# Altium schematic sheet Power.SchDoc
size A3; SheetNumber: 2; SheetTotal: 6
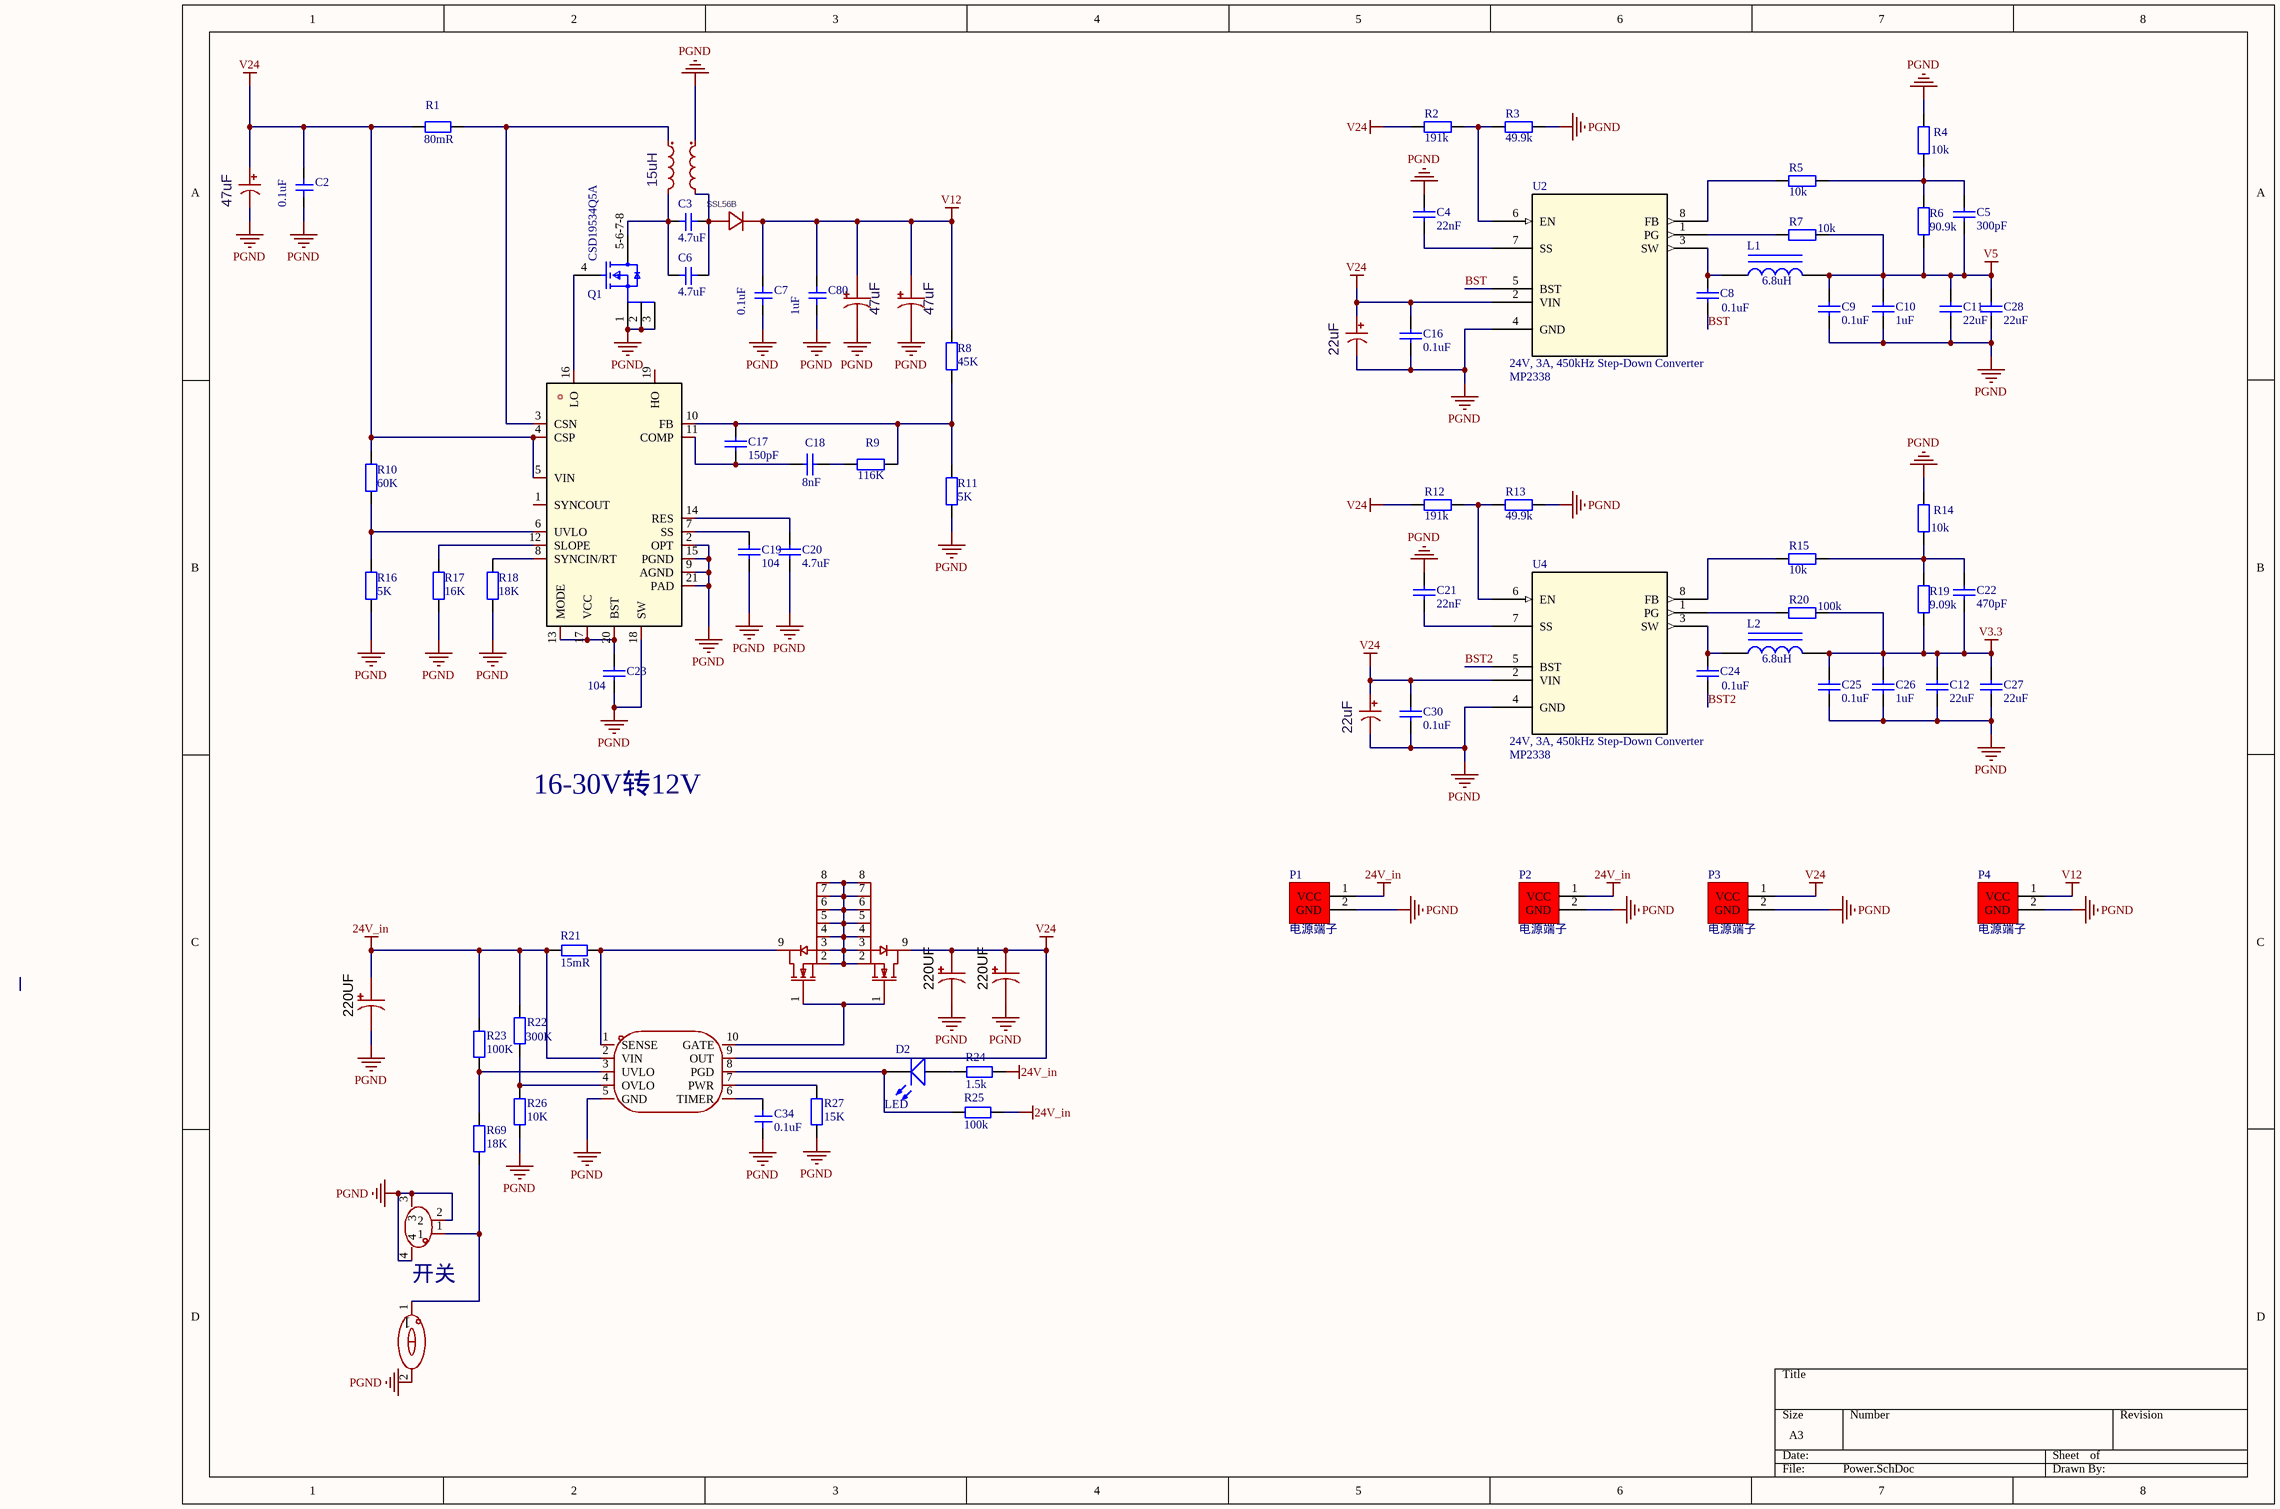
[diagram p0: Power.SchDoc]

## Parts
C1  47uF  [CAP-SMD_BD6.3-L6.6-W6.6-LS7.6-FD]
C2  0.1uF  [0603C]
C3  4.7uF  [1206_C]
C4  22nF  [0402_C]
C5  300pF  [0402_C]
C6  4.7uF  [1206_C]
C7  0.1uF  [0603C]
C8  0.1uF  [0603_C]
C9  0.1uF  [0603_C]
C10  1uF  [0603_C]
C11  22uF  [1210_C]
C12  22uF  [1210_C]
C13  47uF  [CAP-SMD_BD6.3-L6.6-W6.6-LS7.6-FD]
C14  47uF  [CAP-SMD_BD6.3-L6.6-W6.6-LS7.6-FD]
C15  22uF  [CAP-SMD_BD6.3-L6.6-W6.6-LS7.6-FD]
C16  0.1uF  [0603_C]
C17  150pF  [0402_C]
C18  8nF  [0402_C]
C19  104  [0402_C]
C20  4.7uF  [0603_C]
C21  22nF  [0402_C]
C22  470pF  [0402_C]
C23  104  [0402_C]
C24  0.1uF  [0603_C]
C25  0.1uF  [0603_C]
C26  1uF  [0603_C]
C27  22uF  [1210_C]
C28  22uF  [1210_C]
C29  22uF  [CAP-SMD_BD6.3-L6.6-W6.6-LS7.6-FD]
C30  0.1uF  [0603_C]
C31  220UF  [CAP-SMD_BD10.0-L10.3-W10.3-LS11.3-FD]
C32  220UF  [CAP-SMD_BD10.0-L10.3-W10.3-LS11.3-FD]
C33  220UF  [CAP-SMD_BD10.0-L10.3-W10.3-LS11.3-FD]
C34  0.1uF  [0402_C]
C80  1uF  [0603C]
D1  SSL56B  [SMBF_L4.3-W3.6-LS5.3-RD]
D2  LED  [0805_LED]
L1  6.8uH  [IND-SMD_L7.0-W6.6]
L2  6.8uH  [IND-SMD_L7.0-W6.6]
P1  电源端子  [XT60PB-F]
P2  电源端子  [XT60PB-F]
P3  电源端子  [XT60PB-F]
P4  电源端子  [XT30-F]
Q1  CSD19534Q5A  [FP-DQJ0008A-MFG]
Q2  HYG006N04LS1TA  [TOLL-8_L10.4-W9.9-P1.20-LS11.7-BL]  (value not drawn)
Q3  HYG006N04LS1TA  [TOLL-8_L10.4-W9.9-P1.20-LS11.7-BL]  (value not drawn)
R1  80mR  [2512]
R2  191k  [0402_R]
R3  49.9k  [0402_R]
R4  10k  [0402_R]
R5  10k  [0402_R]
R6  90.9k  [0402_R]
R7  10k  [0402_R]
R8  45K  [0402_R]
R9  116K  [0402_R]
R10  60K  [0402_R]
R11  5K  [0402_R]
R12  191k  [0402_R]
R13  49.9k  [0402_R]
R14  10k  [0402_R]
R15  10k  [0402_R]
R16  5K  [0402_R]
R17  16K  [0402_R]
R18  18K  [0402_R]
R19  9.09k  [0402_R]
R20  100k  [0402_R]
R21  15mR  [2512]
R22  300K  [0402_R]
R23  100K  [0402_R]
R24  1.5k  [0402_R]
R25  100k  [0402_R]
R26  10K  [0402_R]
R27  15K  [0402_R]
R69  18K  [0402_R]
SW1  DSIC01LS-P  [SW-SMD_2P-L3.5-W6.2-P2.54-LS9.8]  (value not drawn)
U1  15uH  [IND-SMD_4P-L12.0-W12.0_496R8C]
U2  24V, 3A, 450kHz Step-Down Converter  [SOT583_MP2338_MNP]
U3  LM5122MHX/NOPB  [HTSSOP-20_L6.5-W4.4-P0.65-LS6.4-BL-EP]  (value not drawn)
U4  24V, 3A, 450kHz Step-Down Converter  [SOT583_MP2338_MNP]
U5  LM5069MMX-2/NOPB  [VSSOP-10_L3.0-W3.0-P0.50-LS4.9-BL]  (value not drawn)
U6  ZX-XH2.54-2PLT  [HC-1.25-2]  (value not drawn)

## Nets
24V_in: C33.1 P1.1(VCC) P2.1(VCC) R21.2 R22.2 R23.2 R24.1 R25.1 U5.2(VIN)
PGND: C1.2 C2.1 C4.2 C7.1 C9.1 C10.1 C11.1 C12.1 C13.2 C14.2 C15.2 C16.1 C19.1 C20.1 C21.2 C23.1 C25.1 C26.1 C27.1 C28.1 C29.2 C30.1 C31.2 C32.2 C33.2 C34.1 C80.1 P1.2(GND) P2.2(GND) P3.2(GND) P4.2(GND) Q1.1(S) Q1.2(S) Q1.3(S) R3.1 R4.2 R11.1 R13.1 R14.2 R16.1 R17.1 R18.1 R26.1 R27.2 SW1.2(PIN2) U1.2 U2.4(GND) U3.2(OPT) U3.9(AGND) U3.15(PGND) U3.18(SW) U3.21(PAD) U4.4(GND) U5.5(GND) U6.2 U6.3 U6.4
V3.3: C12.2 C22.1 C25.2 C26.2 C27.2 L2.2 R19.1 R20.2
V5: C5.1 C9.2 C10.2 C11.2 C28.2 L1.2 R6.1 R7.2
V12: C7.2 C13.1 C14.1 C80.2 D1.1 P4.1(VCC) R8.2
V24: C1.1 C2.2 C15.1 C16.2 C29.1 C30.2 C31.1 C32.1 P3.1(VCC) Q3.9(D) R1.1 R2.2 R10.2 R12.2 U2.2(VIN) U3.4(CSP) U3.5(VIN) U4.2(VIN) U5.9(OUT)
BST: C8.1 U2.5(BST)
BST2: C24.1 U4.5(BST)
NetC3_1: C3.1 C6.1 Q1.5-6-7-8(D) U1.3
NetC3_2: C3.2 C6.2 D1.2 U1.4
NetC4_1: C4.1 U2.7(SS)
NetC5_2: C5.2 R4.1 R5.1 R6.2
NetC8_2: C8.2 L1.1 U2.3(SW)
NetC17_1: C17.1 C18.1 U3.11(COMP)
NetC17_2: C17.2 R8.1 R9.2 R11.2 U3.10(FB)
NetC18_2: C18.2 R9.1
NetC19_2: C19.2 U3.7(SS)
NetC20_2: C20.2 U3.14(RES)
NetC21_1: C21.1 U4.7(SS)
NetC22_2: C22.2 R14.1 R15.1 R19.2
NetC23_2: C23.2 U3.13(MODE) U3.17(VCC) U3.20(BST)
NetC24_2: C24.2 L2.1 U4.3(SW)
NetC34_2: C34.2 U5.6(TIMER)
NetD2_A: D2.A R24.2
NetD2_K: D2.K R25.2 U5.8(PGD)
NetQ1_4: Q1.4(G) U3.16(LO)
NetQ2_1: Q2.1(G) Q3.1(G) U5.10(GATE)
NetQ2_2: Q2.2(S) Q2.3(S) Q2.4(S) Q2.5(S) Q2.6(S) Q2.7(S) Q2.8(S) Q3.2(S) Q3.3(S) Q3.4(S) Q3.5(S) Q3.6(S) Q3.7(S) Q3.8(S)
NetQ2_9: Q2.9(D) R21.1 U5.1(SENSE)
NetR1_2: R1.2 U1.1 U3.3(CSN)
NetR2_1: R2.1 R3.2 U2.6(EN)
NetR5_2: R5.2 U2.8(FB)
NetR7_1: R7.1 U2.1(PG)
NetR10_1: R10.1 R16.2 U3.6(UVLO)
NetR12_1: R12.1 R13.2 U4.6(EN)
NetR15_2: R15.2 U4.8(FB)
NetR17_2: R17.2 U3.12(SLOPE)
NetR18_2: R18.2 U3.8(SYNCIN/RT)
NetR20_1: R20.1 U4.1(PG)
NetR22_1: R22.1 R26.2 U5.4(OVLO)
NetR23_1: R23.1 R69.2 U5.3(UVLO)
NetR27_1: R27.1 U5.7(PWR)
NetR69_1: R69.1 SW1.1(PIN1) U6.1

Not connected (* = marked no-connect by the designer): U3 1(SYNCOUT) 19(HO)

## Notes on the sheet
- (near U2) MP2338
- (near U4) MP2338
- 16-30V转12V
- 开关

## Library data of the parts
C1 = cap: 电解电容; Manufacturer: ROQANG(容强); Symbol: RVT1H470M0607; Device: RVT1H470M0607_C72523; Add into BOM: yes; Tolerance: ±20%; Rated Voltage: 50V; Ripple Current: 66mA@120Hz; φD: 6.3mm; L: 7.7mm; Lifetime @ Temp: 2000hrs@105℃; LCSC Part Name: 47uF ±20% 50V; Supplier Part: C72523; Manufacturer Part: RVT1H470M0607; Supplier Footprint: SMD,D6.3xL7.7mm; JLCPCB Part Class: Extended Part; Datasheet: https://atta.szlcsc.com/upload/public/pdf/source/20170325/1490427950282.pdf; Supplier: LCSC; Convert to PCB: yes; Value: 47uF; Equivalent Series Resistance(ESR): -; Operating Temperature: -40℃~+105℃
C2 C3 C6 C7 C34 C80 = Cap1: 无极贴片电容
C4 C5 C8-C12 C16-C28 C30 = SMT_Cap: 贴片电容; ComponentLink1Description: 供应商链接; ComponentLink1URL: http://www.szlcsc.com/product/details_29010.html; Package: 0805; Supplier: LC; SuppliersPartNumber: C28260
C13 C14 = cap2: 47uf 63v 2.1A@100KHZ; Manufacturer: PANASONIC(松下); Symbol: 50SVPF39M; Add into BOM: yes; Value: 39uF; Tolerance: ±20%; Rated Voltage: 50V; Ripple Current: 3.8A@100kHz; Equivalent Series Resistance(ESR): 25mΩ@100kHz; Type: 聚合物; φD: 8mm; L: 11.9mm; Lifetime @ Temp: 5000hrs@105℃; Device: 50SVPF39M; LCSC Part Name: 39uF ±20% 50V; Supplier Part: C193240; Manufacturer Part: 50SVPF39M; Supplier Footprint: SMD,D8xL11.9mm; JLCPCB Part Class: Extended Part; Datasheet: https://atta.szlcsc.com/upload/public/pdf/source/20180515/C193240_1760EBD42554E7EBE44F52996FA994CF.pdf; Supplier: LCSC; Convert to PCB: yes; Lead Spacing: 3.5mm; Operating Temperature: -55℃~+105℃
C15 C29 = cap: 电解电容; Manufacturer: ROQANG(容强); Symbol: RVT1H470M0607; Device: RVT1H470M0607_C72523; Add into BOM: yes; Value: 47uF; Tolerance: ±20%; Rated Voltage: 50V; Ripple Current: 66mA@120Hz; φD: 6.3mm; L: 7.7mm; Lifetime @ Temp: 2000hrs@105℃; LCSC Part Name: 47uF ±20% 50V; Supplier Part: C72523; Manufacturer Part: RVT1H470M0607; Supplier Footprint: SMD,D6.3xL7.7mm; JLCPCB Part Class: Extended Part; Datasheet: https://atta.szlcsc.com/upload/public/pdf/source/20170325/1490427950282.pdf; Supplier: LCSC; Convert to PCB: yes; Equivalent Series Resistance(ESR): -; Operating Temperature: -40℃~+105℃
C31-C33 = cap: 4.7uf 50v 14mA@120HZ; Manufacturer: ROQANG(容强); Symbol: VT1H4R7M0405; Add into BOM: yes; Tolerance: ±20%; φD: 4mm; L: 5.4mm; Lifetime @ Temp: 2000hrs@105℃; Device: VT1H4R7M0405; LCSC Part Name: 4.7uF ±20% 50V; Supplier Part: C213488; Manufacturer Part: VT1H4R7M0405; Supplier Footprint: SMD,D4xL5.4mm; JLCPCB Part Class: Extended Part; Datasheet: https://atta.szlcsc.com/upload/public/pdf/source/20180502/C191859_5B846418F1FC4C14CCCE0409874E2ED6.pdf; Supplier: LCSC; Convert to PCB: yes; Value: 4.7uF; Rated Voltage: 50V; Ripple Current: 14mA@120Hz; Equivalent Series Resistance(ESR): -; Operating Temperature: -40℃~+105℃
D1 = SSL56B_C28646279: 正向压降(Vf): 500mV@5A / 直流反向耐压(Vr): 60V / 整流电流: 5A 肖特基二极管; Manufacturer: 宏迦橙; Add into BOM: yes; Diode Configuration: 独立式; Reverse Leakage Current (Ir): 1mA@60V; Symbol: SSL56B_C28646279; Device: SSL56B_C28646279; LCSC Part Name: 电压:60V 电流:5A; Supplier Part: C28646279; Manufacturer Part: SSL56B; Supplier Footprint: SMB; JLCPCB Part Class: Extended Part; Datasheet: https://atta.szlcsc.com/upload/public/pdf/source/20240711/BA5CC29A704E203730EE96C503711B74.pdf; Supplier: LCSC; Convert to PCB: yes; Forward Voltage (Vf@If): 500mV@5A; Reverse Voltage (Vr): 60V; Rectified Current: 5A
D2 = LED: 发光二极管; ComponentLink1Description: 供应商链接; ComponentLink1URL: http://www.szlcsc.com/product/details_2663.html; Package: 0603; Supplier: LC; SuppliersPartNumber: C2290
L1 L2 = SMT_Iud_Power: 功率电感; ComponentLink1Description: 供应商链接; ComponentLink1URL: http://www.szlcsc.com/product/details_30010.html; Package: 0603; Supplier: LC; SuppliersPartNumber: C29258
Q1 = CMP-04962-000018-1: MOSFET N-CH 100V 50 8SON; Manufacturer: Texas Instruments; Reverse Recovery Time: 53ns; Turn Off Delay Time: 20ns; Gate To Source Voltage: 20V; Turn On Delay Time: 9ns; Depletion Mode: False; Threshold Vgs Max: 3.4V; Pulse Drain Current: 137A; Number Of N Channels: 1; Input Capacitace At Vds: 1290pF @ 50V; Max Junction Temp: +150°C; Power Dissipation: 3.2W; Max Forward Diode Voltage: 1V; Continuous Drain Current: 10A; Drain To Source Resistance: 12.6mΩ; Threshold Vgs Min: 2.4V; Transconductance: 47S; Gate Charge At Vgs: 17nC @ 10V; Reverse Recovery Charge: 134nC; Typ Forward Diode Voltage: 0.8V; Rthja Max: 50°C/W; Drain To Source Breakdown Voltage: 100V; Device Class L2: Transistors; Height: 1.1mm; Temperature Range Low: -55°C; Temperature Range High: +150°C; Temperature: -55°C to +150°C; Device Class L1: Discrete Semiconductors; ComponentLink2Description: Datasheet; Number Of Channels: 1; Lead Free: Yes; Octopart: https://octopart.com/csd19534q5a-texas+instruments-46749514; Package: DQJ0008A; Category: Trans; Mouser Description: MOSFET N-Channel MOSFET; Device Class L3: MOSFETs; Digikey Description: MOSFET N-CH 100V 50 8SON; Drain To Source Voltage: 100V; Automotive: No; ComponentLink2URL: http://www.ti.com/lit/ds/symlink/csd19534q5a.pdf; RoHS: TRUE; Manufacturer Part Number: CSD19534Q5A
Q2 Q3 = HYG006N04LS1TA: Manufacturer: HUAYI(华羿微); Add into BOM: yes; Type: 1个N沟道; Drain Source Voltage (Vdss): 40V; Continuous Drain Current (Id): 600A; Drain Source On Resistance (RDS(on)@Vgs,Id): 0.61mΩ@4.5V,80A; Power Dissipation (Pd): 428W; Gate Threshold Voltage (Vgs(th)@Id): 1.8V@250uA; Total Gate Charge (Qg@Vgs): 230nC@10V; Input Capacitance (Ciss@Vds): 15.4nF@0V; Reverse Transfer Capacitance (Crss@Vds): 115pF; Symbol: HYG006N04LS1TA; Device: HYG006N04LS1TA; LCSC Part Name: 1个N沟道 耐压:40V 电流:600A; Supplier Part: C2982928; Manufacturer Part: HYG006N04LS1TA; Supplier Footprint: TOLL; JLCPCB Part Class: Extended Part; Datasheet: https://atta.szlcsc.com/upload/public/pdf/source/20220321/91BDC8248F772C15069ACBA52C025F8E.pdf; Supplier: LCSC; Convert to PCB: yes; Operating Temperature: -55℃~+175℃
R1 R21-R27 R69 = Res: 电阻
R2-R9 R11-R15 R19 R20 = SMT_Res: 贴片电阻; ComponentLink1Description: 供应商链接; ComponentLink1URL: http://www.szlcsc.com/product/details_23980.html; Package: 0603; Supplier: LC; SuppliersPartNumber: C23253
R10 R16-R18 = SMT_Res_1: 贴片电阻; ComponentLink1Description: 供应商链接; ComponentLink1URL: http://www.szlcsc.com/product/details_23980.html; Package: 0603; Supplier: LC; SuppliersPartNumber: C23253
SW1 = 拨码开关: 1P; Manufacturer: XKB Connectivity(中国星坤); Symbol: DSIC01LS-P_C600988; Add into BOM: yes; Circuit: 单刀单掷; Number of Positions: 1位; Pin Style: 鸥翼型; Current Rating: 25mA; Voltage Rating: 24V; Operating Life: 3千次; Device: DSIC01LS-P; LCSC Part Name: 平拨,凸起式 1位拨码开关; Supplier Part: C600988; Manufacturer Part: DSIC01LS-P; Supplier Footprint: SMD,3.5x6.2mm; JLCPCB Part Class: Extended Part; Datasheet: https://atta.szlcsc.com/upload/public/pdf/source/20181029/C319044_89B44386426E378AA9595AB22F0589AA.pdf; Supplier: LCSC; Convert to PCB: yes; Type: 平拨,凸起式; Lead Pitch: -; Operating Temperature: -20℃~+70℃; Color: 黑色
U1 = YPRH1207C-150M: 耦合电感 15uH 5A; Manufacturer: YJYCOIN(益嘉源); Add into BOM: yes; Symbol: YPRH1207C-150M; Device: YPRH1207C-150M; LCSC Part Name: 共模电感1207 15uH ±20% 5A 65mΩ; Supplier Part: C22387937; Manufacturer Part: YPRH1207C-150M; Supplier Footprint: SMD-4P,12x12mm; JLCPCB Part Class: Extended Part; Datasheet: https://atta.szlcsc.com/upload/public/pdf/source/20240423/295998868374F51F4A3F6DF00C7F68FC.pdf; Supplier: LCSC; Convert to PCB: yes
U2 U4 = MP2338GTL-P: High-Efficiency, 28V, 3A, 450kHz, / Synchronous Step-Down Converter / In SOT583 Package; Mfr_Name: Monolithic Power Systems; RefDes: RefDes; Type: Type
U3 = LM5122MHX/NOPB: Manufacturer: TI(德州仪器); Add into BOM: yes; Function: 升压型; Input Voltage: 4.5V~65V; Switching Frequency: 450kHz；875kHz; Synchronous Rectification: 是; Number of Outputs: 1; Topology: 升压式; Switch tube (built-in/external): 外置; Symbol: LM5122MHX/NOPB; Device: LM5122MHX/NOPB; LCSC Part Name: 宽输入范围同步升压控制器; Supplier Part: C77241; Manufacturer Part: LM5122MHX/NOPB; Supplier Footprint: HTSSOP-20-EP; JLCPCB Part Class: Extended Part; Datasheet: https://www.ti.com/cn/lit/gpn/lm5122; Supplier: LCSC; Convert to PCB: yes; Output Current: -; Operating Temperature: -40℃~+125℃@(TJ)
U5 = LM5069MMX-2/NOPB: Manufacturer: TI(德州仪器); Add into BOM: yes; Voltage Rating: 9V~80V; Symbol: LM5069MMX-2/NOPB; Device: LM5069MMX-2/NOPB; LCSC Part Name: LM5069MMX 2/NOPB; Supplier Part: C2653582; Manufacturer Part: LM5069MMX-2/NOPB; Supplier Footprint: VSSOP-10-0.5mm; JLCPCB Part Class: Extended Part; Datasheet: https://www.ti.com/cn/lit/gpn/lm5069; Supplier: LCSC; Convert to PCB: yes
U6 = ZX-XH2.54-2PLT: Manufacturer: Megastar(兆星); Add into BOM: yes; Pins Structure: 1x2P; Pitch: 2.5mm; Reference Series: XH; Number of PINs Per Row: 2; Supplementary Features: 辅助焊脚; Z-Height of the Board: 8mm; X-Length of Bottom Edge on Board (Spacing Line): 10mm; Y-Width of Bottom Edge on Board: 8.3mm; Symbol: ZX-XH2.54-2PLT; Device: ZX-XH2.54-2PLT; LCSC Part Name: 1x2P 间距:2.5mm 立贴 系列:XH; Supplier Part: C7429680; Manufacturer Part: ZX-XH2.54-2PLT; Supplier Footprint: SMD,P=2.5mm,立贴; JLCPCB Part Class: Extended Part; Datasheet: https://atta.szlcsc.com/upload/public/pdf/source/20230619/87C018EBE425F10E4B035B436CF5FBBC.pdf; Supplier: LCSC; Convert to PCB: yes; Mounting Type: 立贴; Number of Pins: 2P; Number of Rows: 1; Row Spacing: -; Current Rating: -; Contact Material: 黄铜; Contact Plating: 锡; Operating Temperature: -; Voltage Rating: -; Plastic Material: -; Flame Retardant Rating: -; Color: 米色